# EAGLE design DAC breakout (EAGLE 7.4.0)
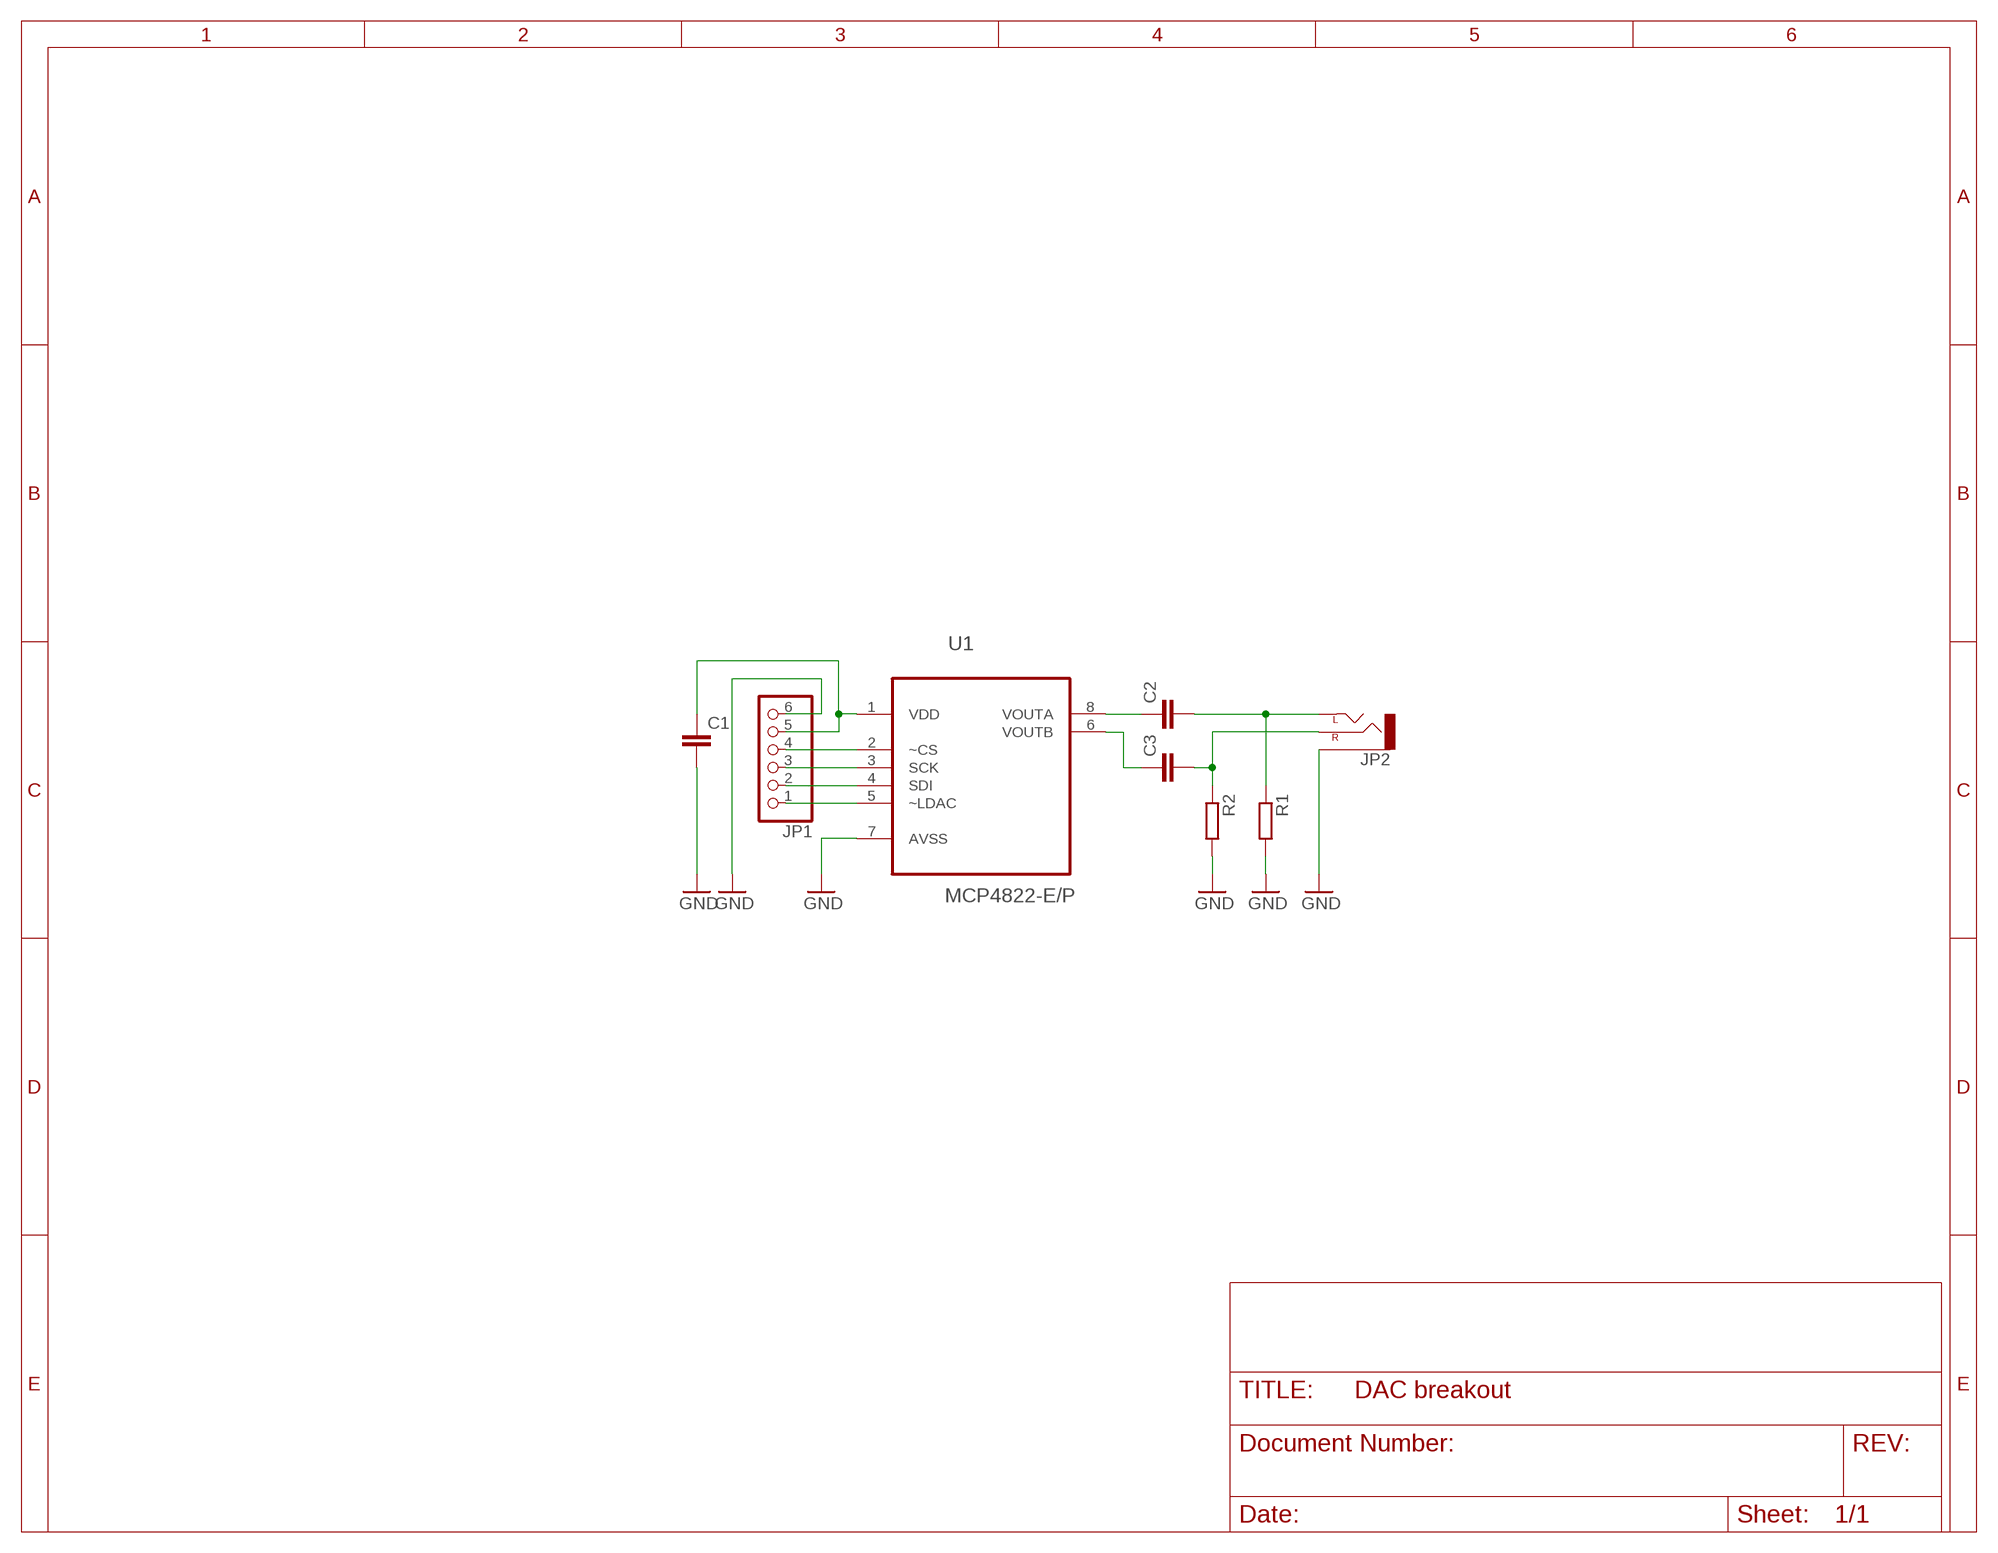
[diagram p0: schematic, sheet 1]

## Parts
C1  C5/3  [C5B3]
C2  C5/3  [C5B3]
C3  C5/3  [C5B3]
JP1  PINHD-1X6  [1X06]
JP2  AUDIO-JACKPTH  [AUDIO-JACK]
R1  R-EU_0204/7  [0204/7]
R2  R-EU_0204/7  [0204/7]
U1  MCP4822-E/P  [DIP254P762X432-8]

## Nets
GND: C1.2 JP1.6 JP2.SLEEVE R1.2 R2.2 U1.7(AVSS)
N$1: JP1.1 U1.5(~LDAC)
N$2: JP1.2 U1.4(SDI)
N$3: JP1.3 U1.3(SCK)
N$4: JP1.4 U1.2(~CS)
N$5: C1.1 JP1.5 U1.1(VDD)
N$6: C3.2 JP2.RING(RIGHT) R2.1
N$7: C2.1 U1.8(VOUTA)
N$8: C3.1 U1.6(VOUTB)
N$9: C2.2 JP2.TIP(LEFT) R1.1

## Library data of the parts
C1-C3 = capacitor-wima:C: CAPACITOR naming: grid - package width
JP1 = pinhead:PINHD-1X6: PIN HEADER
JP2 = SparkFun-Connectors:AUDIO-JACK: 3.5mm Audio Jack Simple 3.5mm common PCB mount audio jack. Variant PTH is our storefront SKU PRT-08032
R1 R2 = resistor:R-EU_: RESISTOR, European symbol
U1 = Microchip_By_element14_Batch_1:MCP4822-E/P: DAC; MPN: MCP4822-E/P; OC_FARNELL: 1439413; OC_NEWARK: 11M1705; PACKAGE: DIP-8; SUPPLIER: Microchip

## Board
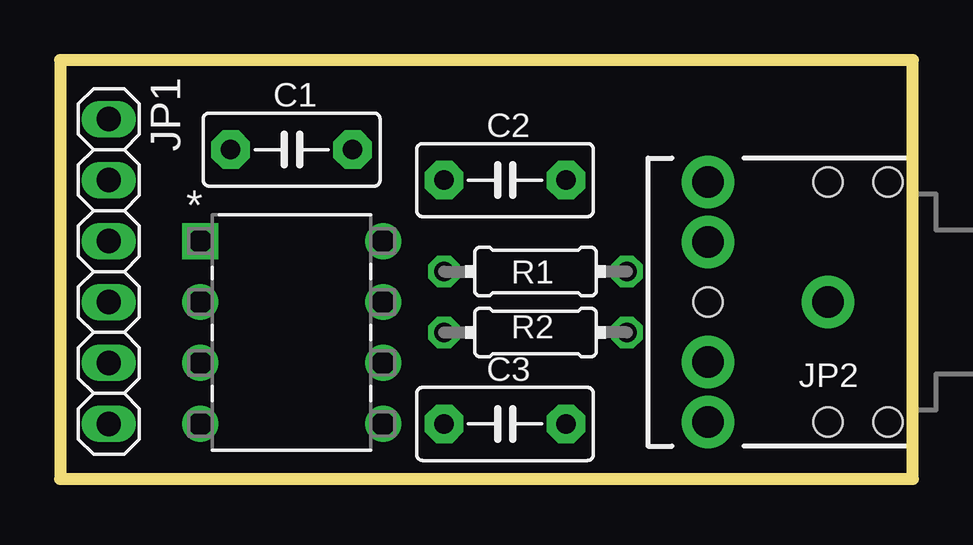
[diagram p1: board, top side]
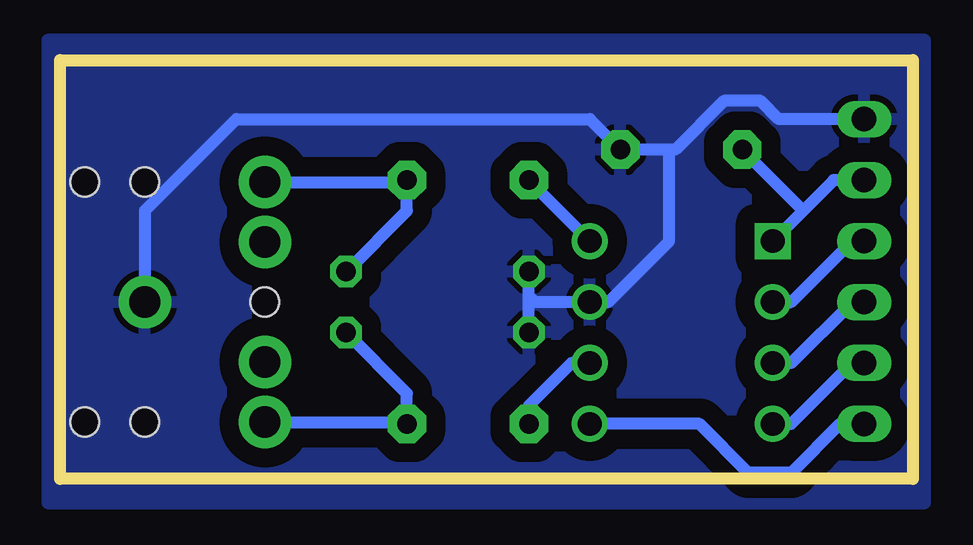
[diagram p2: board, bottom side, seen from below]

Size 35.54 x 17.45 mm. Coordinates in mm from the lower left corner, seen from the top.
Outline: 0,0 35.54,0 35.54,17.45 0,17.45 0,0
Copper layers (1*16): Top 0.035mm / dielectric 1.5mm / Bottom 0.035mm
Design rules "Othermill-DRC-1-32": minimum track width 8mil, minimum drill 0.8mm, track to track 0.794003125mm, track to pad 0.794003125mm, pad to pad 0.794003125mm, via to via 0.794003125mm, smd to smd 0mil, copper to edge 0mil, drill to drill 1mil, minimum pad ring 10mil, minimum via ring 10mil, stop-mask expansion 1mil, vias tented up to drill 30mil, thermal gap 10mil

### Footprints (pad centres in the part's own frame; a part is rotated, then mirrored left to right if it is on the bottom)
C5B3 = drill 0.813 pad 1.6 octagon: 1 -2.54,0; 2 2.54,0
1X06 = drill 1.016 long: 1 -6.35,0; 2 -3.81,0; 3 -1.27,0; 4 1.27,0; 5 3.81,0; 6 6.35,0
AUDIO-JACK = drill 1.3 pad 2.184: RING 5,5; RSH 5,2.5; SLEEVE 0,0; TIP 5,-5; TSH 5,-2.5 | hole 1.2: 0,5; -2.5,5; -2.5,-5; 0,-5; 5,0
0204/7 = drill 0.813 octagon: 1 -3.81,0; 2 3.81,0
DIP254P762X432-8 = drill 0.991 square: 1 -7.62,7.62 | drill 0.991: 2 -7.62,5.08; 3 -7.62,2.54; 4 -7.62,0; 5 0,0; 6 0,2.54; 7 0,5.08; 8 0,7.62

### Placement (x,y rotation side)
C1  9.65,13.72 0 top
C2  18.54,12.45 0 top
C3  18.54,2.29 0 top
JP1  2.03,8.64 90 top
JP2  32,7.37 180 top
R1  19.81,8.64 180 top
R2  19.81,6.1 180 top
U1  13.46,2.29 0 top

### Tracks (layer width: path | path; a pad name or v marks a point on that pad's centre or on a via)
GND
  Bottom 0.508: JP1.6 5.59,14.99 6.35,15.75 7.87,15.75 9.91,13.72 10.16,13.72 | 10.16,13.72 C1.2 13.46,14.99 28.19,14.99 32,11.18 JP2.SLEEVE | R2.2 16,7.62 | 16,7.62 R1.2 | 10.16,13.72 10.16,9.91 12.7,7.37 U1.7 15.75,7.37 16,7.62
  pour Bottom: -0.51,-0.51 -0.51,18.29 36.07,18.29 36.07,17.78 36.07,-1.02 -0.51,-1.02
N$1
  Bottom 0.508: JP1.1 3.05,2.29 5.08,0.25 6.86,0.25 8.89,2.29 U1.5
N$2
  Bottom 0.508: U1.4 5.08,2.29 2.54,4.83 JP1.2
N$3
  Bottom 0.508: U1.3 5.08,4.83 2.54,7.37 JP1.3
N$4
  Bottom 0.508: U1.2 5.08,7.37 2.54,9.91 JP1.4
N$5
  Bottom 0.508: JP1.5 3.3,12.45 4.57,11.18 | 4.57,11.18 U1.1 | C1.1 4.57,11.18
N$6
  Bottom 0.508: R2.1 21.08,3.56 C3.2 21.08,2.37 JP2.RING
N$7
  Bottom 0.508: U1.8 C2.1
N$8
  Bottom 0.508: U1.6 14.22,4.83 16,3.05 C3.1
N$9
  Bottom 0.508: R1.1 21.08,11.18 C2.2 21.08,12.37 JP2.TIP